# Altium schematic sheet mag_mpu.SchDoc
size A4
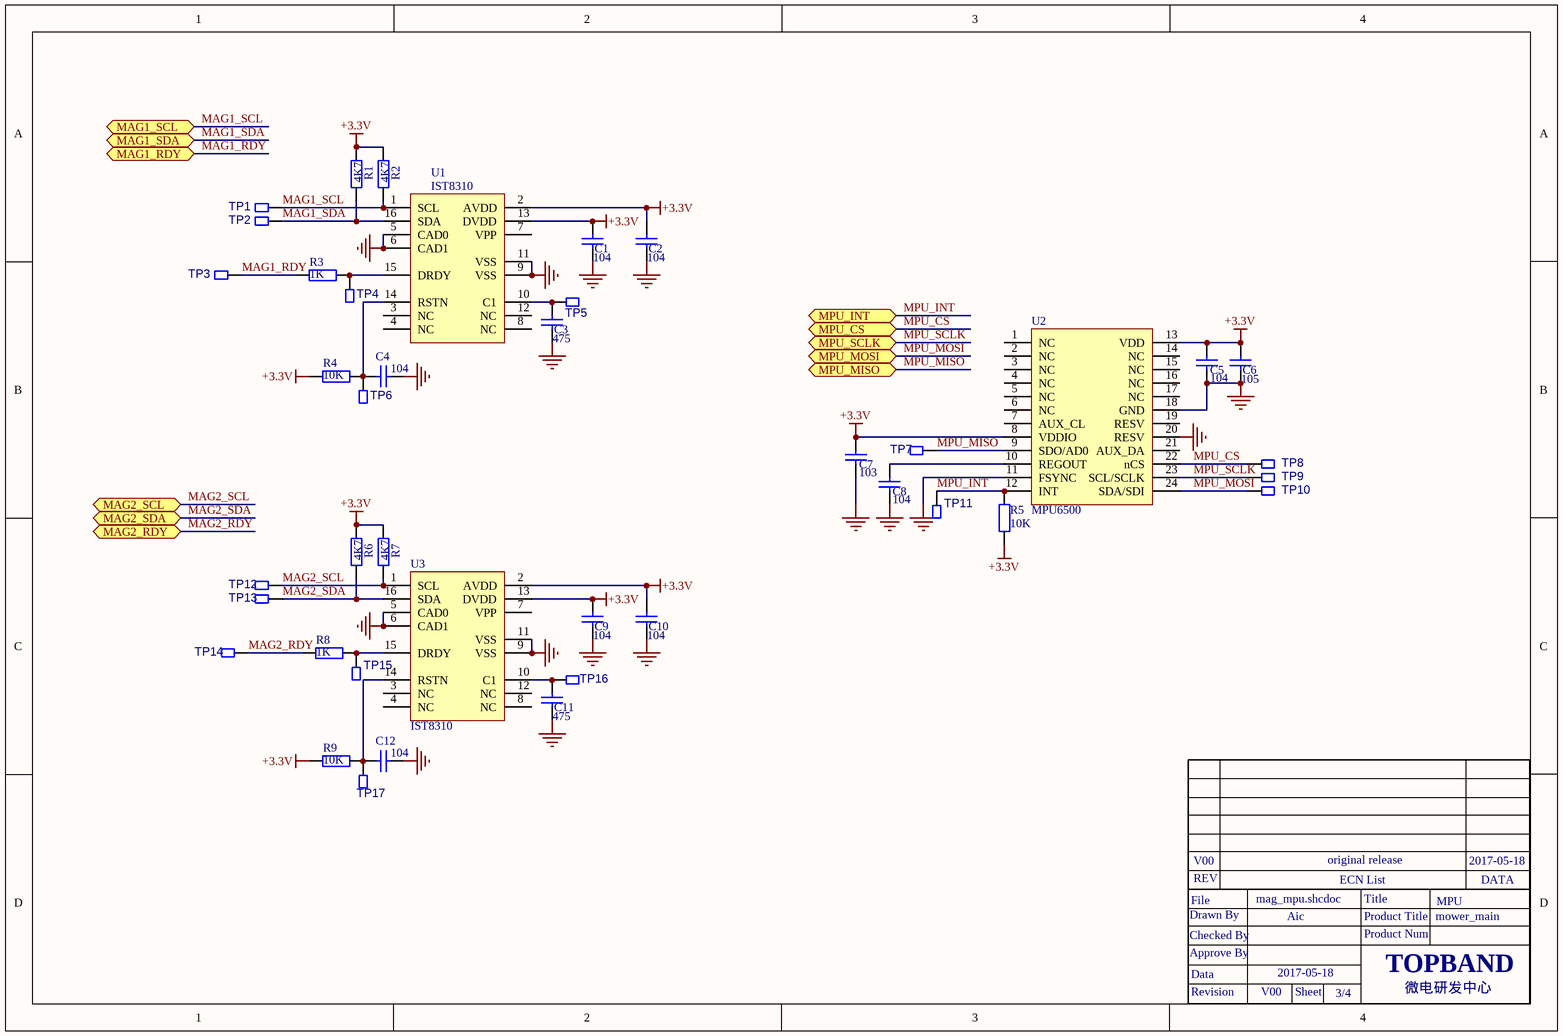
[diagram p0: mag_mpu.SchDoc]

## Parts
C1  104  [0603C]
C2  104  [0603C]
C3  475  [0603C]
C4  104  [0603C]
C5  104  [0603C]
C6  105  [0603C]
C7  103  [0603C]
C8  104  [0603C]
C9  104  [0603C]
C10  104  [0603C]
C11  475  [0603C]
C12  104  [0603C]
R1  4K7  [0603R]
R2  4K7  [0603R]
R3  1K  [0603R]
R4  10K  [0603R]
R5  10K  [0603R]
R6  4K7  [0603R]
R7  4K7  [0603R]
R8  1K  [0603R]
R9  10K  [0603R]
TP1  TP  [TEST-0.8MM]  (value not drawn)
TP2  TP  [TEST-0.8MM]  (value not drawn)
TP3  TP  [TEST-0.8MM]  (value not drawn)
TP4  TP  [TEST-0.8MM]  (value not drawn)
TP5  TP  [TEST-0.8MM]  (value not drawn)
TP6  TP  [TEST-0.8MM]  (value not drawn)
TP7  TP  [TEST-0.8MM]  (value not drawn)
TP8  TP  [TEST-0.8MM]  (value not drawn)
TP9  TP  [TEST-0.8MM]  (value not drawn)
TP10  TP  [TEST-0.8MM]  (value not drawn)
TP11  TP  [TEST-0.8MM]  (value not drawn)
TP12  TP  [TEST-0.8MM]  (value not drawn)
TP13  TP  [TEST-0.8MM]  (value not drawn)
TP14  TP  [TEST-0.8MM]  (value not drawn)
TP15  TP  [TEST-0.8MM]  (value not drawn)
TP16  TP  [TEST-0.8MM]  (value not drawn)
TP17  TP  [TEST-0.8MM]  (value not drawn)
U1  IST8310  [QFN16]
U2  MPU6500  [QFN24]
U3  IST8310  [QFN16]

## Ports
MAG1_RDY, MAG1_SCL, MAG1_SDA, MAG2_RDY, MAG2_SCL, MAG2_SDA, MPU_CS, MPU_INT, MPU_MISO, MPU_MOSI, MPU_SCLK

## Nets
+3.3V: C1.2 C2.2 C5.2 C6.2 C7.2 C9.2 C10.2 R1.2 R2.2 R4.1 R5.2 R6.2 R7.2 R9.1 U1.2(AVDD) U1.13(DVDD) U2.8(VDDIO) U2.13(VDD) U3.2(AVDD) U3.13(DVDD)
GND: C1.1 C2.1 C3.1 C4.1 C5.1 C6.1 C7.1 C8.1 C9.1 C10.1 C11.1 C12.1 U1.5(CAD0) U1.6(CAD1) U1.9(VSS) U1.11(VSS) U2.11(FSYNC) U2.18(GND) U2.20(RESV) U3.5(CAD0) U3.6(CAD1) U3.9(VSS) U3.11(VSS)
MAG1_RDY: R3.2 TP3.1 ; port MAG1_RDY
MAG1_SCL: R2.1 TP1.1 U1.1(SCL) ; port MAG1_SCL
MAG1_SDA: R1.1 TP2.1 U1.16(SDA) ; port MAG1_SDA
MAG2_RDY: R8.2 TP14.1 ; port MAG2_RDY
MAG2_SCL: R7.1 TP12.1 U3.1(SCL) ; port MAG2_SCL
MAG2_SDA: R6.1 TP13.1 U3.16(SDA) ; port MAG2_SDA
MPU_CS: TP8.1 U2.22(nCS) ; port MPU_CS
MPU_INT: R5.1 TP11.1 U2.12(INT) ; port MPU_INT
MPU_MISO: TP7.1 U2.9(SDO/AD0) ; port MPU_MISO
MPU_MOSI: TP10.1 U2.24(SDA/SDI) ; port MPU_MOSI
MPU_SCLK: TP9.1 U2.23(SCL/SCLK) ; port MPU_SCLK
NetC3_2: C3.2 TP5.1 U1.10(C1)
NetC4_2: C4.2 R4.2 TP6.1 U1.14(RSTN)
NetC8_2: C8.2 U2.10(REGOUT)
NetC11_2: C11.2 TP16.1 U3.10(C1)
NetC12_2: C12.2 R9.2 TP17.1 U3.14(RSTN)
NetR3_1: R3.1 TP4.1 U1.15(DRDY)
NetR8_1: R8.1 TP15.1 U3.15(DRDY)

Not connected (* = marked no-connect by the designer): U1 3(NC) 4(NC) 7(VPP) 8(NC) 12(NC); U2 1(NC) 2(NC) 3(NC) 4(NC) 5(NC) 6(NC) 7(AUX_CL) 14(NC) 15(NC) 16(NC) 17(NC) 19(RESV) 21(AUX_DA); U3 3(NC) 4(NC) 7(VPP) 8(NC) 12(NC)

## Notes on the sheet
- Drawn By
- File
- REV
- V00
- mag_mpu.shcdoc
- Aic
- original release
- ECN List
- Product Title
- Title
- mower_main
- MPU
- 2017-05-18
- DATA
- Approve By
- Checked By
- Data
- Product Num
- TOPBAND
- Revision
- Sheet
- 3/4
- 微电研发中心

## Library data of the parts
C1-C12 = Cap(0603): Component Kind: standard; Component Type: standard
R1 R2 R4-R7 R9 = Res2: Resistor; Value: 1K; 物料编码: 150103083; Published: 8-Jun-2000; LatestRevisionDate: 17-Jul-2002; LatestRevisionNote: Re-released for DXP Platform.; PackageReference: AXIAL-0.4; Publisher: Altium Limited
R3 R8 = Res2: Resistor; 物料编码: 150103083; Published: 8-Jun-2000; LatestRevisionDate: 17-Jul-2002; LatestRevisionNote: Re-released for DXP Platform.; PackageReference: AXIAL-0.4; Publisher: Altium Limited; Value: 1K